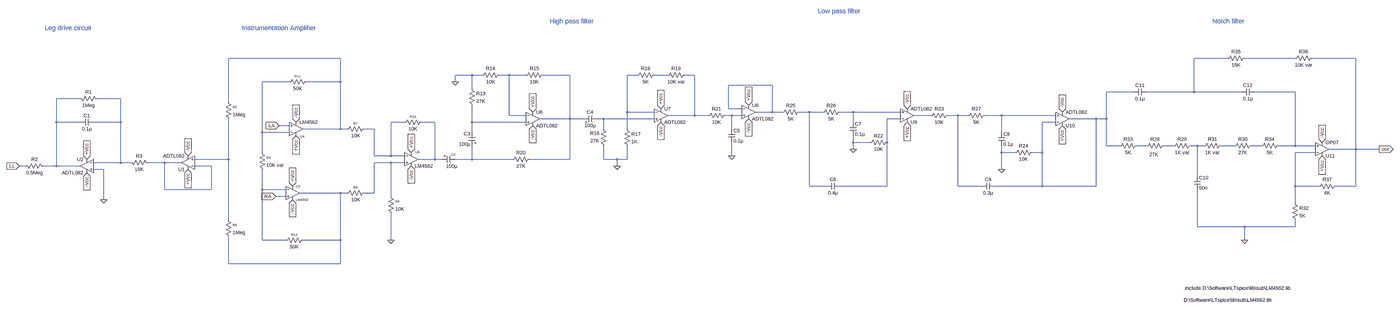
[diagram p0: schematic full cct.asc, whole sheet]
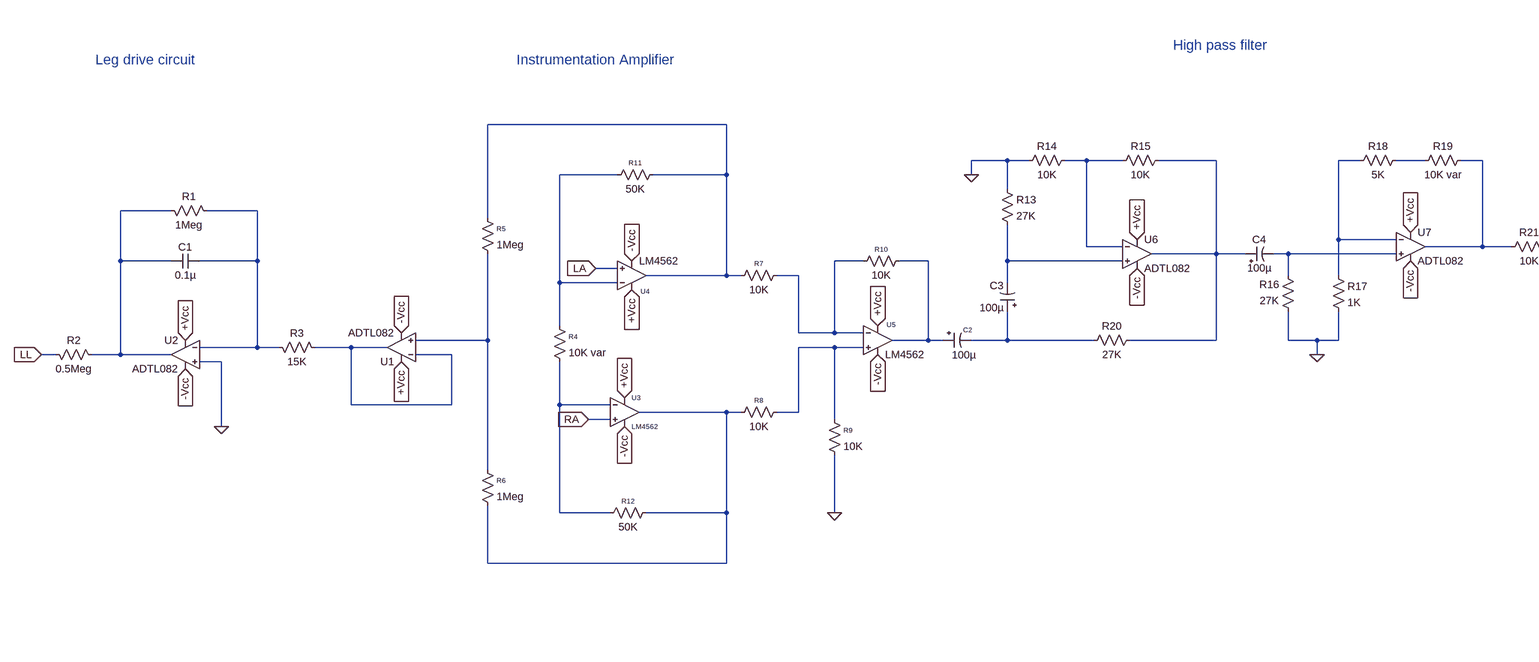
[diagram p1: schematic full cct.asc, part, row 1 of 1, column 1 of 2]
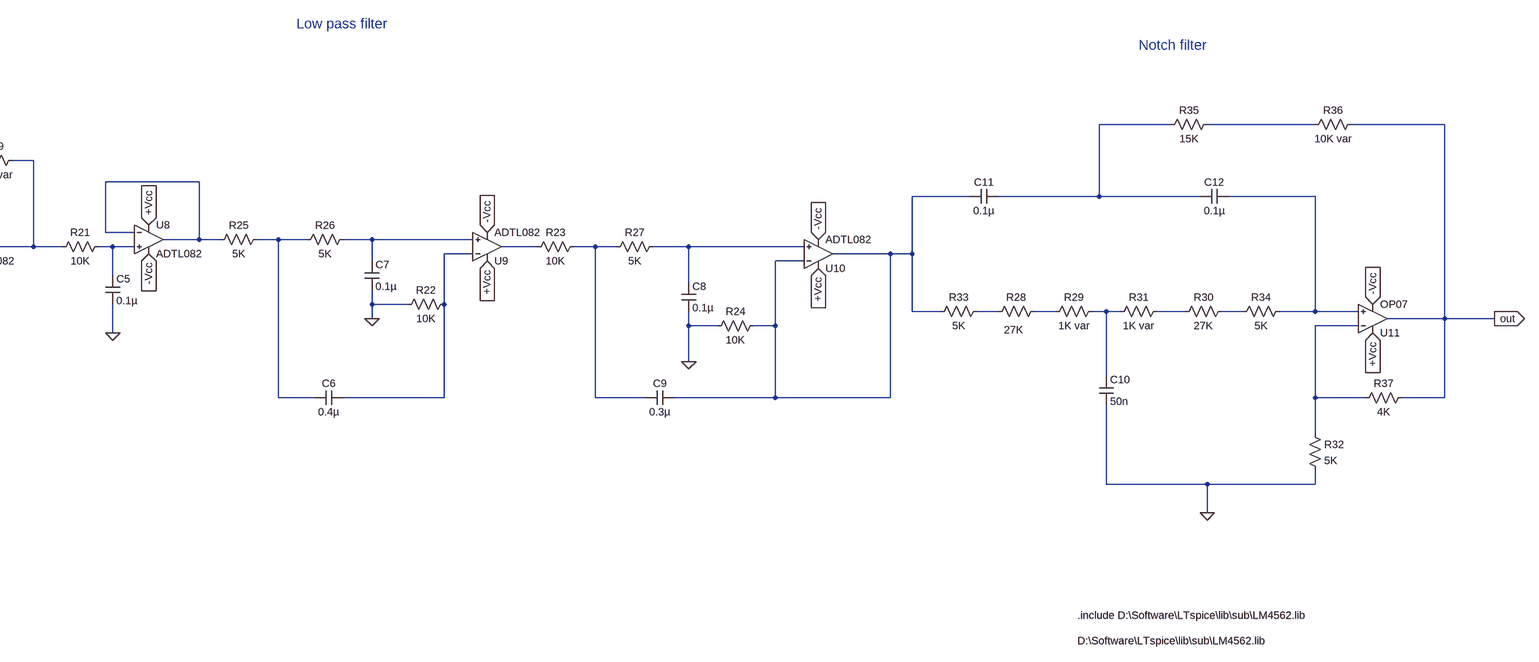
[diagram p2: schematic full cct.asc, part, row 1 of 1, column 2 of 2]
full cct.asc, the LTspice schematic file:
Version 4
SHEET 1 5552 1528
WIRE -192 -16 -736 -16
WIRE 4016 -16 3856 -16
WIRE 4336 -16 4096 -16
WIRE 4624 -16 4416 -16
WIRE 432 64 352 64
WIRE 480 64 432 64
WIRE 608 64 560 64
WIRE 688 64 608 64
WIRE 896 64 768 64
WIRE 1216 64 1168 64
WIRE 1360 64 1296 64
WIRE 1488 64 1440 64
WIRE -448 96 -576 96
WIRE -192 96 -192 -16
WIRE -192 96 -368 96
WIRE 352 96 352 64
WIRE 1856 112 1648 112
WIRE 432 128 432 64
WIRE 3568 144 3440 144
WIRE 3856 144 3856 -16
WIRE 3856 144 3632 144
WIRE 4080 144 3856 144
WIRE 4336 144 4144 144
WIRE -1440 176 -1552 176
WIRE -1248 176 -1360 176
WIRE -736 192 -736 -16
WIRE 1648 224 1648 112
WIRE 1712 224 1648 224
WIRE 1168 240 1168 64
WIRE 1296 240 1168 240
WIRE 1856 240 1856 112
WIRE 1856 240 1776 240
WIRE 1904 240 1856 240
WIRE 2032 240 1984 240
WIRE 2096 240 2032 240
WIRE 2240 240 2176 240
WIRE 2464 240 2240 240
WIRE 608 256 608 64
WIRE 688 256 608 256
WIRE 1488 256 1488 64
WIRE 1488 256 1360 256
WIRE 1552 256 1488 256
WIRE 1664 256 1632 256
WIRE 1712 256 1664 256
WIRE 2608 256 2528 256
WIRE 2736 256 2688 256
WIRE 2784 256 2736 256
WIRE 2944 256 2864 256
WIRE 3200 256 2944 256
WIRE 896 272 896 64
WIRE 896 272 752 272
WIRE 960 272 896 272
WIRE 1056 272 1024 272
WIRE 1296 272 1056 272
WIRE 2464 272 2400 272
WIRE 3392 272 3264 272
WIRE 3440 272 3440 144
WIRE 3440 272 3392 272
WIRE -1552 288 -1552 176
WIRE -1440 288 -1552 288
WIRE -1248 288 -1248 176
WIRE -1248 288 -1376 288
WIRE 112 288 48 288
WIRE 256 288 192 288
WIRE 432 288 432 208
WIRE 688 288 432 288
WIRE 2240 288 2240 240
WIRE 3200 288 3136 288
WIRE -448 304 -496 304
WIRE -192 320 -192 96
WIRE -192 320 -384 320
WIRE -160 320 -192 320
WIRE -32 320 -80 320
WIRE 1056 320 1056 272
WIRE 1168 320 1168 240
WIRE 1664 320 1664 256
WIRE -576 336 -576 96
WIRE -448 336 -576 336
WIRE 432 336 432 288
WIRE 2944 336 2944 256
WIRE 2240 384 2240 352
WIRE 2320 384 2240 384
WIRE 2400 384 2400 272
WIRE 3440 400 3440 272
WIRE 3504 400 3440 400
WIRE 3632 400 3584 400
WIRE 3760 400 3712 400
WIRE 3872 400 3840 400
WIRE 3904 400 3872 400
WIRE 4048 400 3984 400
WIRE 4176 400 4128 400
WIRE 4336 400 4336 144
WIRE 4336 400 4256 400
WIRE 4432 400 4336 400
WIRE 2240 416 2240 384
WIRE 4624 416 4624 -16
WIRE 4624 416 4496 416
WIRE 4736 416 4624 416
WIRE -576 432 -576 336
WIRE 2944 432 2944 400
WIRE 3008 432 2944 432
WIRE 3136 432 3136 288
WIRE 3136 432 3088 432
WIRE 4432 432 4336 432
WIRE -32 448 -32 320
WIRE 48 448 48 288
WIRE 48 448 -32 448
WIRE 112 448 48 448
WIRE 1664 448 1664 384
WIRE -736 464 -736 272
WIRE -736 464 -896 464
WIRE 256 464 256 288
WIRE 256 464 176 464
WIRE 288 464 256 464
WIRE 432 464 432 400
WIRE 432 464 352 464
WIRE 624 464 432 464
WIRE 896 464 896 272
WIRE 896 464 704 464
WIRE 1056 464 1056 400
WIRE 1120 464 1056 464
WIRE 1168 464 1168 400
WIRE 1168 464 1120 464
WIRE -1248 480 -1248 288
WIRE -1248 480 -1376 480
WIRE -1200 480 -1248 480
WIRE -1040 480 -1120 480
WIRE -960 480 -1040 480
WIRE 48 480 -32 480
WIRE 112 480 48 480
WIRE -1696 496 -1728 496
WIRE -1552 496 -1552 288
WIRE -1552 496 -1616 496
WIRE -1440 496 -1552 496
WIRE -816 496 -896 496
WIRE 1120 496 1120 464
WIRE -1328 512 -1376 512
WIRE 2944 512 2944 432
WIRE 3872 544 3872 400
WIRE 2032 592 2032 240
WIRE 2112 592 2032 592
WIRE 2400 592 2400 384
WIRE 2400 592 2176 592
WIRE 2736 592 2736 256
WIRE 2848 592 2736 592
WIRE 3136 592 3136 432
WIRE 3136 592 2912 592
WIRE 3392 592 3392 272
WIRE 3392 592 3136 592
WIRE 4336 592 4336 432
WIRE 4448 592 4336 592
WIRE 4624 592 4624 416
WIRE 4624 592 4528 592
WIRE -1040 608 -1040 480
WIRE -816 608 -816 496
WIRE -816 608 -1040 608
WIRE -576 608 -576 512
WIRE -464 608 -576 608
WIRE -192 624 -400 624
WIRE -160 624 -192 624
WIRE -32 624 -32 480
WIRE -32 624 -80 624
WIRE -464 640 -512 640
WIRE 48 640 48 480
WIRE -1328 656 -1328 512
WIRE 4336 672 4336 592
WIRE -736 752 -736 464
WIRE 3872 784 3872 608
WIRE 4096 784 3872 784
WIRE 4336 784 4336 752
WIRE 4336 784 4096 784
WIRE -576 848 -576 608
WIRE -464 848 -576 848
WIRE -192 848 -192 624
WIRE -192 848 -384 848
WIRE 48 848 48 720
WIRE 4096 848 4096 784
WIRE -736 960 -736 832
WIRE -192 960 -192 848
WIRE -192 960 -736 960
FLAG -1328 656 0
FLAG -928 512 +Vcc
IOPIN -928 512 In
FLAG -1408 464 +Vcc
IOPIN -1408 464 In
FLAG -928 448 -Vcc
IOPIN -928 448 In
FLAG -1408 528 -Vcc
IOPIN -1408 528 In
FLAG -1728 496 LL
IOPIN -1728 496 In
FLAG 48 848 0
FLAG -496 304 LA
IOPIN -496 304 In
FLAG -512 640 RA
IOPIN -512 640 In
FLAG -416 352 +Vcc
IOPIN -416 352 In
FLAG -432 656 -Vcc
IOPIN -432 656 In
FLAG -432 592 +Vcc
IOPIN -432 592 In
FLAG -416 288 -Vcc
IOPIN -416 288 In
FLAG 144 432 +Vcc
IOPIN 144 432 In
FLAG 144 496 -Vcc
IOPIN 144 496 In
FLAG 720 240 +Vcc
IOPIN 720 240 In
FLAG 1328 224 +Vcc
IOPIN 1328 224 In
FLAG 720 304 -Vcc
IOPIN 720 304 In
FLAG 1328 288 -Vcc
IOPIN 1328 288 In
FLAG 352 96 0
FLAG 1120 496 0
FLAG 2240 416 0
FLAG 1664 448 0
FLAG 2944 512 0
FLAG 1744 208 +Vcc
IOPIN 1744 208 In
FLAG 3232 304 +Vcc
IOPIN 3232 304 In
FLAG 2496 288 +Vcc
IOPIN 2496 288 In
FLAG 1744 272 -Vcc
IOPIN 1744 272 In
FLAG 2496 224 -Vcc
IOPIN 2496 224 In
FLAG 3232 240 -Vcc
IOPIN 3232 240 In
FLAG 4096 848 0
FLAG 4736 416 out
IOPIN 4736 416 Out
FLAG 4464 448 +Vcc
IOPIN 4464 448 In
FLAG 4464 384 -Vcc
IOPIN 4464 384 In
SYMBOL OpAmps\\ADTL082 -928 544 R180
SYMATTR InstName U1
SYMBOL OpAmps\\ADTL082 -1408 432 M0
SYMATTR InstName U2
SYMBOL cap -1440 272 M90
WINDOW 0 0 32 VBottom 2
WINDOW 3 32 32 VTop 2
SYMATTR InstName C1
SYMATTR Value 0.1µ
SYMBOL res -1456 160 M90
WINDOW 0 0 56 VBottom 2
WINDOW 3 32 56 VTop 2
SYMATTR InstName R1
SYMATTR Value 1Meg
SYMBOL res -1712 480 M90
WINDOW 0 0 56 VBottom 2
WINDOW 3 32 56 VTop 2
SYMATTR InstName R2
SYMATTR Value 0.5Meg
SYMBOL res -1216 464 M90
WINDOW 0 0 56 VBottom 2
WINDOW 3 32 56 VTop 2
SYMATTR InstName R3
SYMATTR Value 15K
SYMBOL OpAmps\\opamp2 -432 560 R0
WINDOW 0 16 32 Left 1
WINDOW 3 16 96 Left 1
SYMATTR InstName U3
SYMATTR Value LM4562
SYMBOL OpAmps\\opamp2 -416 384 M180
WINDOW 0 20 29 Left 1
SYMATTR InstName U4
SYMATTR Value LM4562
SYMBOL res -592 416 R0
WINDOW 0 36 40 Left 1
SYMATTR InstName R4
SYMATTR Value 10K var
SYMBOL res -752 176 R0
WINDOW 0 36 40 Left 1
SYMATTR InstName R5
SYMATTR Value 1Meg
SYMATTR SpiceLine tol=1 pwr=0.1
SYMBOL res -752 736 R0
WINDOW 0 36 40 Left 1
SYMATTR InstName R6
SYMATTR Value 1Meg
SYMATTR SpiceLine tol=1 pwr=0.1
SYMBOL OpAmps\\opamp2 144 400 R0
WINDOW 0 20 29 Left 1
SYMATTR InstName U5
SYMATTR Value LM4562
SYMBOL res -64 304 R90
WINDOW 0 0 56 VBottom 1
WINDOW 3 32 56 VTop 2
SYMATTR InstName R7
SYMATTR Value 10K
SYMBOL res -64 608 R90
WINDOW 0 0 56 VBottom 1
WINDOW 3 32 56 VTop 2
SYMATTR InstName R8
SYMATTR Value 10K
SYMBOL res 32 624 R0
WINDOW 0 36 40 Left 1
SYMATTR InstName R9
SYMATTR Value 10K
SYMBOL res 208 272 R90
WINDOW 0 0 56 VBottom 1
WINDOW 3 32 56 VTop 2
SYMATTR InstName R10
SYMATTR Value 10K
SYMBOL polcap 288 448 M90
WINDOW 0 3 56 VBottom 1
WINDOW 3 33 48 VTop 2
SYMATTR InstName C2
SYMATTR Value 100µ
SYMATTR Description Capacitor
SYMATTR Type cap
SYMATTR SpiceLine V=6.3 Irms=4.08248 Rser=0.015 Lser=0 mfg="KEMET" pn="A700D107M006ATE015" type="Al electrolytic"
SYMBOL res -352 80 R90
WINDOW 0 0 56 VBottom 1
WINDOW 3 32 56 VTop 2
SYMATTR InstName R11
SYMATTR Value 50K
SYMBOL res -368 832 R90
WINDOW 0 0 56 VBottom 1
WINDOW 3 32 56 VTop 2
SYMATTR InstName R12
SYMATTR Value 50K
SYMBOL OpAmps\\ADTL082 720 208 R0
SYMATTR InstName U6
SYMBOL OpAmps\\ADTL082 1328 192 R0
SYMATTR InstName U7
SYMBOL res 416 112 R0
SYMATTR InstName R13
SYMATTR Value 27K
SYMBOL res 576 48 R90
WINDOW 0 0 56 VBottom 2
WINDOW 3 32 56 VTop 2
SYMATTR InstName R14
SYMATTR Value 10K
SYMBOL res 784 48 R90
WINDOW 0 0 56 VBottom 2
WINDOW 3 32 56 VTop 2
SYMATTR InstName R15
SYMATTR Value 10K
SYMBOL res 1072 416 R180
WINDOW 0 36 76 Left 2
WINDOW 3 36 40 Left 2
SYMATTR InstName R16
SYMATTR Value 27K
SYMBOL res 1152 304 R0
SYMATTR InstName R17
SYMATTR Value 1K
SYMBOL res 1200 80 R270
WINDOW 0 32 56 VTop 2
WINDOW 3 0 56 VBottom 2
SYMATTR InstName R18
SYMATTR Value 5K
SYMBOL res 1344 80 R270
WINDOW 0 32 56 VTop 2
WINDOW 3 0 56 VBottom 2
SYMATTR InstName R19
SYMATTR Value 10K var
SYMBOL res 720 448 R90
WINDOW 0 0 56 VBottom 2
WINDOW 3 32 56 VTop 2
SYMATTR InstName R20
SYMATTR Value 27K
SYMBOL polcap 448 400 R180
WINDOW 0 24 57 Left 2
WINDOW 3 24 8 Left 2
SYMATTR InstName C3
SYMATTR Value 100µ
SYMATTR Description Capacitor
SYMATTR Type cap
SYMATTR SpiceLine V=6.3 Irms=4.08248 Rser=0.015 Lser=0 mfg="KEMET" pn="A700D107M006ATE015" type="Al electrolytic"
SYMBOL polcap 960 288 R270
WINDOW 0 32 32 VTop 2
WINDOW 3 0 32 VBottom 2
SYMATTR InstName C4
SYMATTR Value 100µ
SYMATTR Description Capacitor
SYMATTR Type cap
SYMATTR SpiceLine V=6.3 Irms=4.08248 Rser=0.015 Lser=0 mfg="KEMET" pn="A700D107M006ATE015" type="Al electrolytic"
SYMBOL OpAmps\\ADTL082 1744 176 R0
SYMATTR InstName U8
SYMBOL res 1648 240 R90
WINDOW 0 0 56 VBottom 2
WINDOW 3 32 56 VTop 2
SYMATTR InstName R21
SYMATTR Value 10K
SYMBOL cap 1648 320 R0
SYMATTR InstName C5
SYMATTR Value 0.1µ
SYMATTR SpiceLine V=6.3 Irms=0 Rser=0 Lser=0 mfg="Murata" pn="GRM011R60J103KE01" type="X5R"
SYMBOL OpAmps\\ADTL082 2496 320 M180
SYMATTR InstName U9
SYMBOL cap 2176 576 R90
WINDOW 0 0 32 VBottom 2
WINDOW 3 32 32 VTop 2
SYMATTR InstName C6
SYMATTR Value 0.4µ
SYMBOL cap 2224 288 R0
SYMATTR InstName C7
SYMATTR Value 0.1µ
SYMBOL res 2416 368 R90
WINDOW 0 0 56 VBottom 2
WINDOW 3 32 56 VTop 2
SYMATTR InstName R22
SYMATTR Value 10K
SYMBOL res 2704 240 R90
WINDOW 0 0 56 VBottom 2
WINDOW 3 32 56 VTop 2
SYMATTR InstName R23
SYMATTR Value 10K
SYMBOL OpAmps\\ADTL082 3232 336 M180
SYMATTR InstName U10
SYMBOL cap 2928 336 R0
SYMATTR InstName C8
SYMATTR Value 0.1µ
SYMBOL res 3104 416 R90
WINDOW 0 0 56 VBottom 2
WINDOW 3 32 56 VTop 2
SYMATTR InstName R24
SYMATTR Value 10K
SYMBOL cap 2912 576 R90
WINDOW 0 0 32 VBottom 2
WINDOW 3 32 32 VTop 2
SYMATTR InstName C9
SYMATTR Value 0.3µ
SYMBOL res 2000 224 R90
WINDOW 0 0 56 VBottom 2
WINDOW 3 32 56 VTop 2
SYMATTR InstName R25
SYMATTR Value 5K
SYMBOL res 2192 224 R90
WINDOW 0 0 56 VBottom 2
WINDOW 3 32 56 VTop 2
SYMATTR InstName R26
SYMATTR Value 5K
SYMBOL res 2880 240 R90
WINDOW 0 0 56 VBottom 2
WINDOW 3 32 56 VTop 2
SYMATTR InstName R27
SYMATTR Value 5K
SYMBOL res 3728 384 R90
WINDOW 0 0 56 VBottom 2
WINDOW 3 41 62 VTop 2
SYMATTR InstName R28
SYMATTR Value 27K
SYMBOL res 3856 384 R90
WINDOW 0 0 56 VBottom 2
WINDOW 3 32 56 VTop 2
SYMATTR InstName R29
SYMATTR Value 1K var
SYMBOL res 4032 416 R270
WINDOW 0 32 56 VTop 2
WINDOW 3 0 56 VBottom 2
SYMATTR InstName R30
SYMATTR Value 27K
SYMBOL res 3888 416 R270
WINDOW 0 32 56 VTop 2
WINDOW 3 0 56 VBottom 2
SYMATTR InstName R31
SYMATTR Value 1K var
SYMBOL OpAmps\\OP07 4464 480 M180
SYMATTR InstName U11
SYMBOL res 4320 656 R0
SYMATTR InstName R32
SYMATTR Value 5K
SYMBOL res 3600 384 R90
WINDOW 0 0 56 VBottom 2
WINDOW 3 32 56 VTop 2
SYMATTR InstName R33
SYMATTR Value 5K
SYMBOL res 4272 384 R90
WINDOW 0 0 56 VBottom 2
WINDOW 3 32 56 VTop 2
SYMATTR InstName R34
SYMATTR Value 5K
SYMBOL cap 3856 544 R0
SYMATTR InstName C10
SYMATTR Value 50n
SYMBOL cap 3632 128 R90
WINDOW 0 0 32 VBottom 2
WINDOW 3 32 32 VTop 2
SYMATTR InstName C11
SYMATTR Value 0.1µ
SYMBOL cap 4144 128 R90
WINDOW 0 0 32 VBottom 2
WINDOW 3 32 32 VTop 2
SYMATTR InstName C12
SYMATTR Value 0.1µ
SYMBOL res 4112 -32 R90
WINDOW 0 0 56 VBottom 2
WINDOW 3 32 56 VTop 2
SYMATTR InstName R35
SYMATTR Value 15K
SYMBOL res 4432 -32 R90
WINDOW 0 0 56 VBottom 2
WINDOW 3 32 56 VTop 2
SYMATTR InstName R36
SYMATTR Value 10K var
SYMBOL res 4544 576 R90
WINDOW 0 0 56 VBottom 2
WINDOW 3 32 56 VTop 2
SYMATTR InstName R37
SYMATTR Value 4K
TEXT 3808 1264 Left 2 !D:\\Software\\LTspice\\lib\\sub\\LM4562.lib
TEXT 3808 1208 Left 2 !.include D:\\Software\\LTspice\\lib\\sub\\LM4562.lib
TEXT -1608 -160 Left 3 ;Leg drive circuit
TEXT -672 -160 Left 3 ;Instrumentation Amplifier
TEXT 800 -192 Left 3 ;High pass filter
TEXT 2072 -240 Left 3 ;Low pass filter
TEXT 3944 -192 Left 3 ;Notch filter

The netlist it stands for:
* full cct.asc
XU1 N032 N034 +Vcc -Vcc N034 ADTL082  ; pins In+ In- V+ V- OUT
XU2 0 N014 +Vcc -Vcc N013 ADTL082  ; pins In+ In- V+ V- OUT
C1 N013 N014 0.1µ
R1 N013 N014 1Meg
R2 LL N013 0.5Meg
R3 N014 N034 15K
XU3 RA N036 +Vcc -Vcc N037 LM4562  ; pins In+ In- V+ V- OUT
XU4 LA N009 +Vcc -Vcc N001 LM4562  ; pins In+ In- V+ V- OUT
R4 N009 N036 10K var
R5 N001 N032 1Meg tol=1 pwr=0.1
R6 N032 N037 1Meg tol=1 pwr=0.1
XU5 N035 N023 +Vcc -Vcc N024 LM4562  ; pins In+ In- V+ V- OUT
R7 N023 N001 10K
R8 N035 N037 10K
R9 N035 0 10K
R10 N024 N023 10K
C2 N024 N033 100µ V=6.3 Irms=4.08248 Rser=0.015 Lser=0 mfg="KEMET" pn="A700D107M006ATE015" type="Al electrolytic"
R11 N001 N009 50K
R12 N037 N036 50K
XU6 N025 N004 +Vcc -Vcc N005 ADTL082  ; pins In+ In- V+ V- OUT
XU7 N021 N006 +Vcc -Vcc N008 ADTL082  ; pins In+ In- V+ V- OUT
R13 0 N025 27K
R14 N004 0 10K
R15 N005 N004 10K
R16 0 N021 27K
R17 N006 0 1K
R18 N006 N007 5K
R19 N007 N008 10K var
R20 N005 N033 27K
C3 N033 N025 100µ V=6.3 Irms=4.08248 Rser=0.015 Lser=0 mfg="KEMET" pn="A700D107M006ATE015" type="Al electrolytic"
C4 N005 N021 100µ V=6.3 Irms=4.08248 Rser=0.015 Lser=0 mfg="KEMET" pn="A700D107M006ATE015" type="Al electrolytic"
XU8 N017 N010 +Vcc -Vcc N010 ADTL082  ; pins In+ In- V+ V- OUT
R21 N017 N008 10K
C5 N017 0 0.1µ V=6.3 Irms=0 Rser=0 Lser=0 mfg="Murata" pn="GRM011R60J103KE01" type="X5R"
XU9 N016 N022 +Vcc -Vcc N018 ADTL082  ; pins In+ In- V+ V- OUT
C6 N022 N015 0.4µ
C7 N016 0 0.1µ
R22 N022 0 10K
R23 N019 N018 10K
XU10 N020 N011 +Vcc -Vcc N011 ADTL082  ; pins In+ In- V+ V- OUT
C8 N020 0 0.1µ
R24 N011 0 10K
C9 N011 N019 0.3µ
R25 N015 N010 5K
R26 N016 N015 5K
R27 N020 N019 5K
R28 N027 N026 27K
R29 N028 N027 1K var
R30 N029 N030 27K
R31 N028 N029 1K var
XU11 N012 N031 +Vcc -Vcc out LT1001  ; OP07, pins In+ In- V+ V- OUT
R32 N031 0 5K
R33 N026 N011 5K
R34 N012 N030 5K
C10 N028 0 50n
C11 N002 N011 0.1µ
C12 N012 N002 0.1µ
R35 N003 N002 15K
R36 out N003 10K var
R37 out N031 4K
D:\Software\LTspice\lib\sub\LM4562.lib
.include D:\Software\LTspice\lib\sub\LM4562.lib
* Leg drive circuit
* Instrumentation Amplifier
* High pass filter
* Low pass filter
* Notch filter
.lib ADI.lib
.lib LTC.lib
.backanno
.end